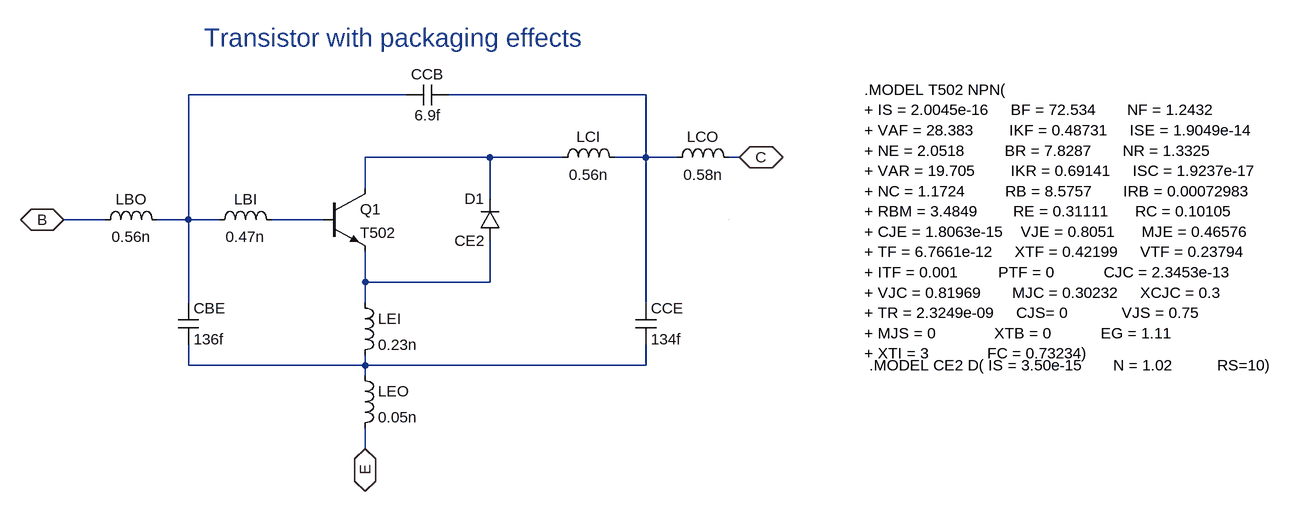
[diagram p0: schematic transistor_encapsulado.asc]
transistor_encapsulado.asc, the LTspice schematic file:
Version 4
SHEET 1 2296 772
WIRE 464 -16 128 -16
WIRE 832 -16 528 -16
WIRE 592 80 400 80
WIRE 704 80 592 80
WIRE 832 80 832 -16
WIRE 832 80 784 80
WIRE 880 80 832 80
WIRE 976 80 960 80
WIRE 400 128 400 80
WIRE 592 144 592 80
WIRE 0 176 -64 176
WIRE 128 176 128 -16
WIRE 128 176 80 176
WIRE 176 176 128 176
WIRE 336 176 256 176
WIRE 400 272 400 224
WIRE 592 272 592 208
WIRE 592 272 400 272
WIRE 128 304 128 176
WIRE 400 304 400 272
WIRE 832 304 832 80
WIRE 128 400 128 368
WIRE 400 400 400 384
WIRE 400 400 128 400
WIRE 832 400 832 368
WIRE 832 400 400 400
WIRE 400 416 400 400
WIRE 400 528 400 496
FLAG -64 176 B
IOPIN -64 176 BiDir
FLAG 976 80 C
IOPIN 976 80 BiDir
FLAG 400 528 E
IOPIN 400 528 BiDir
SYMBOL npn 336 128 R0
SYMATTR InstName Q1
SYMATTR Value T502
SYMBOL diode 608 208 R180
WINDOW 0 24 64 Left 2
WINDOW 3 24 0 Left 2
SYMATTR InstName D1
SYMATTR Value CE2
SYMBOL ind 688 96 R270
WINDOW 0 32 56 VTop 2
WINDOW 3 5 56 VBottom 2
SYMATTR InstName LCI
SYMATTR Value 0.56n
SYMBOL ind 864 96 R270
WINDOW 0 32 56 VTop 2
WINDOW 3 5 56 VBottom 2
SYMATTR InstName LCO
SYMATTR Value 0.58n
SYMBOL ind 160 192 R270
WINDOW 0 32 56 VTop 2
WINDOW 3 5 56 VBottom 2
SYMATTR InstName LBI
SYMATTR Value 0.47n
SYMBOL ind -16 192 R270
WINDOW 0 32 56 VTop 2
WINDOW 3 5 56 VBottom 2
SYMATTR InstName LBO
SYMATTR Value 0.56n
SYMBOL ind 384 288 R0
SYMATTR InstName LEI
SYMATTR Value 0.23n
SYMBOL ind 384 400 R0
SYMATTR InstName LEO
SYMATTR Value 0.05n
SYMBOL cap 112 304 R0
SYMATTR InstName CBE
SYMATTR Value 136f
SYMBOL cap 816 304 R0
SYMATTR InstName CCE
SYMATTR Value 134f
SYMBOL cap 464 0 R270
WINDOW 0 32 32 VTop 2
WINDOW 3 0 32 VBottom 2
SYMATTR InstName CCB
SYMATTR Value 6.9f
TEXT 1168 -24 Left 2 !.MODEL T502 NPN(\n+ IS = 2.0045e-16     BF = 72.534       NF = 1.2432\n+ VAF = 28.383        IKF = 0.48731     ISE = 1.9049e-14\n+ NE = 2.0518         BR = 7.8287       NR = 1.3325\n+ VAR = 19.705        IKR = 0.69141     ISC = 1.9237e-17\n+ NC = 1.1724         RB = 8.5757       IRB = 0.00072983\n+ RBM = 3.4849        RE = 0.31111      RC = 0.10105\n+ CJE = 1.8063e-15    VJE = 0.8051      MJE = 0.46576\n+ TF = 6.7661e-12     XTF = 0.42199     VTF = 0.23794\n+ ITF = 0.001         PTF = 0           CJC = 2.3453e-13\n+ VJC = 0.81969       MJC = 0.30232     XCJC = 0.3\n+ TR = 2.3249e-09     CJS= 0            VJS = 0.75\n+ MJS = 0             XTB = 0           EG = 1.11\n+ XTI = 3             FC = 0.73234)
TEXT 1176 400 Left 2 !.MODEL CE2 D( IS = 3.50e-15       N = 1.02          RS=10)
TEXT 152 -104 Left 4 ;Transistor with packaging effects
RECTANGLE Normal 960 176 960 176 2

The netlist it stands for:
* transistor_encapsulado.asc
Q1 N003 N004 N005 0 T502
D1 N005 N003 CE2
LCI N003 N002 0.56n
LCO N002 C 0.58n
LBI N001 N004 0.47n
LBO B N001 0.56n
LEI N005 N006 0.23n
LEO N006 E 0.05n
CBE N001 N006 136f
CCE N002 N006 134f
CCB N001 N002 6.9f
.model D D
.lib standard.dio
.model NPN NPN
.model PNP PNP
.lib standard.bjt
.MODEL T502 NPN(
+ IS = 2.0045e-16     BF = 72.534       NF = 1.2432
+ VAF = 28.383        IKF = 0.48731     ISE = 1.9049e-14
+ NE = 2.0518         BR = 7.8287       NR = 1.3325
+ VAR = 19.705        IKR = 0.69141     ISC = 1.9237e-17
+ NC = 1.1724         RB = 8.5757       IRB = 0.00072983
+ RBM = 3.4849        RE = 0.31111      RC = 0.10105
+ CJE = 1.8063e-15    VJE = 0.8051      MJE = 0.46576
+ TF = 6.7661e-12     XTF = 0.42199     VTF = 0.23794
+ ITF = 0.001         PTF = 0           CJC = 2.3453e-13
+ VJC = 0.81969       MJC = 0.30232     XCJC = 0.3
+ TR = 2.3249e-09     CJS= 0            VJS = 0.75
+ MJS = 0             XTB = 0           EG = 1.11
+ XTI = 3             FC = 0.73234)
.MODEL CE2 D( IS = 3.50e-15       N = 1.02          RS=10)
* Transistor with packaging effects
.backanno
.end